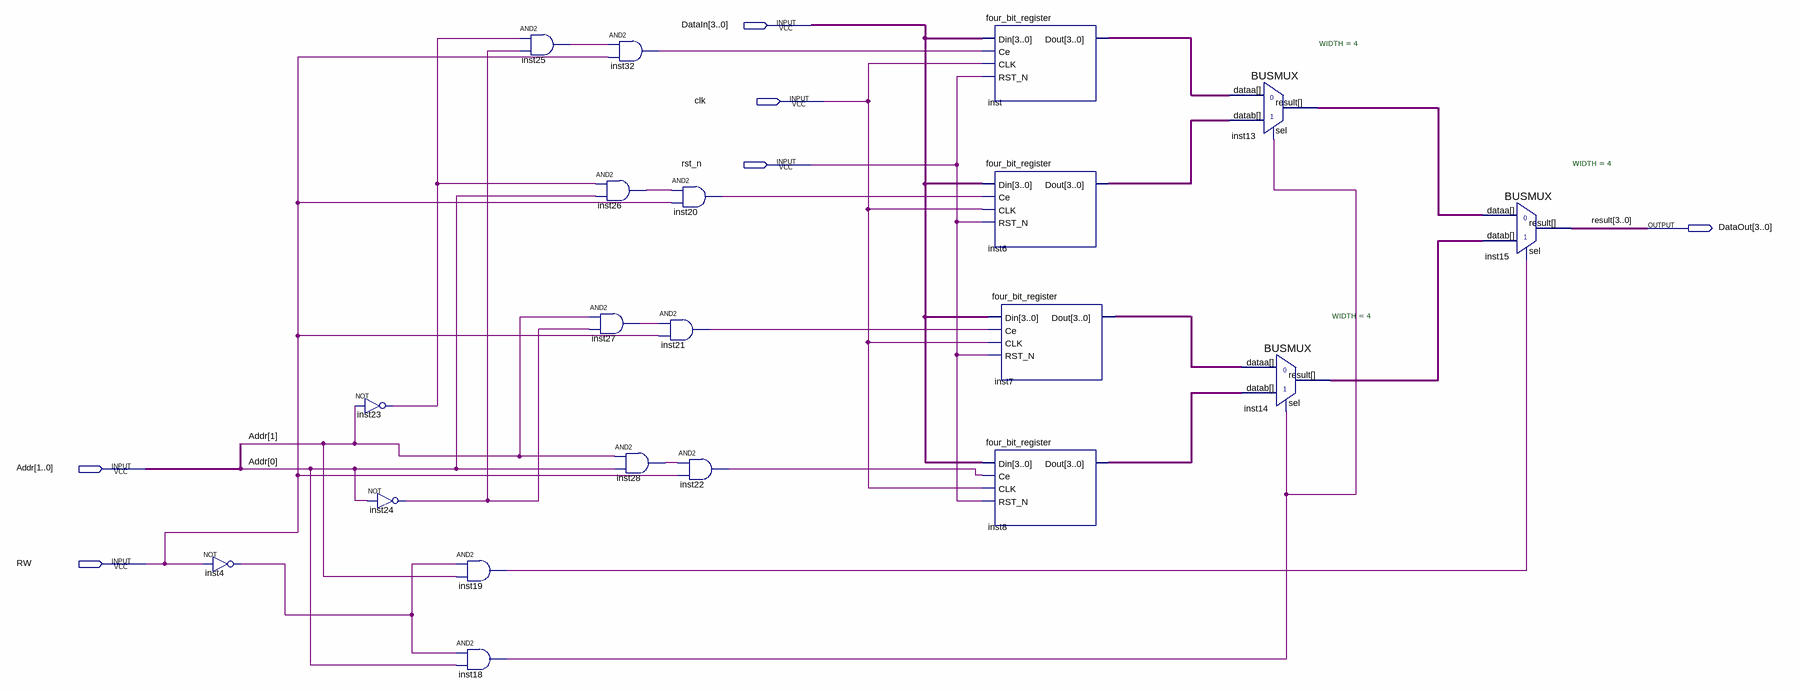
[diagram p0: schematic sheet]
// Quartus schematic sram.bdf as structural Verilog: 20 symbols, 6 pins
module sram (
  input  [3:0] DataIn,
  input  clk,
  input  rst_n,
  input  [1:0] Addr,
  input  RW,
  output [3:0] DataOut
);

  wire inst4_out, inst18_out, inst19_out, inst20_out, inst21_out, inst22_out, inst23_out, inst24_out,
       inst25_out, inst26_out, inst27_out, inst28_out, inst32_out;
  wire [3:0] inst6_dout, inst7_dout, inst8_dout, inst13_result, inst14_result, inst_dout;

  not inst4 (inst4_out, RW);
  not inst23 (inst23_out, Addr[1]);
  not inst24 (inst24_out, Addr[0]);
  and inst19 (inst19_out, inst4_out, Addr[1]);
  and inst18 (inst18_out, inst4_out, Addr[0]);
  and inst25 (inst25_out, inst23_out, inst24_out);
  and inst32 (inst32_out, inst25_out, RW);
  and inst26 (inst26_out, inst23_out, Addr[0]);
  and inst27 (inst27_out, Addr[1], inst24_out);
  and inst28 (inst28_out, Addr[1], Addr[0]);
  and inst20 (inst20_out, inst26_out, RW);
  and inst21 (inst21_out, inst27_out, RW);
  and inst22 (inst22_out, inst28_out, RW);
  four_bit_register inst (.Din(DataIn), .Ce(inst32_out), .CLK(clk), .RST_N(rst_n), .Dout(inst_dout));
  four_bit_register inst6 (.Din(DataIn), .Ce(inst20_out), .CLK(clk), .RST_N(rst_n), .Dout(inst6_dout));
  four_bit_register inst8 (.Din(DataIn), .Ce(inst22_out), .CLK(clk), .RST_N(rst_n), .Dout(inst8_dout));
  four_bit_register inst7 (.Din(DataIn), .Ce(inst21_out), .CLK(clk), .RST_N(rst_n), .Dout(inst7_dout));
  BUSMUX #(.WIDTH(4)) inst13 (.datab(inst6_dout), .sel(inst18_out), .dataa(inst_dout), .result(inst13_result));
  BUSMUX #(.WIDTH(4)) inst14 (.datab(inst8_dout), .sel(inst18_out), .dataa(inst7_dout), .result(inst14_result));
  BUSMUX #(.WIDTH(4)) inst15 (.datab(inst14_result), .sel(inst19_out), .dataa(inst13_result), .result(DataOut));

  // Other names for the same wires on the sheet: result[3:0] = DataOut
endmodule
